# Altium schematic sheet ClockGenerator.SchDoc
size A4; SheetNumber: 1; SheetTotal: 5
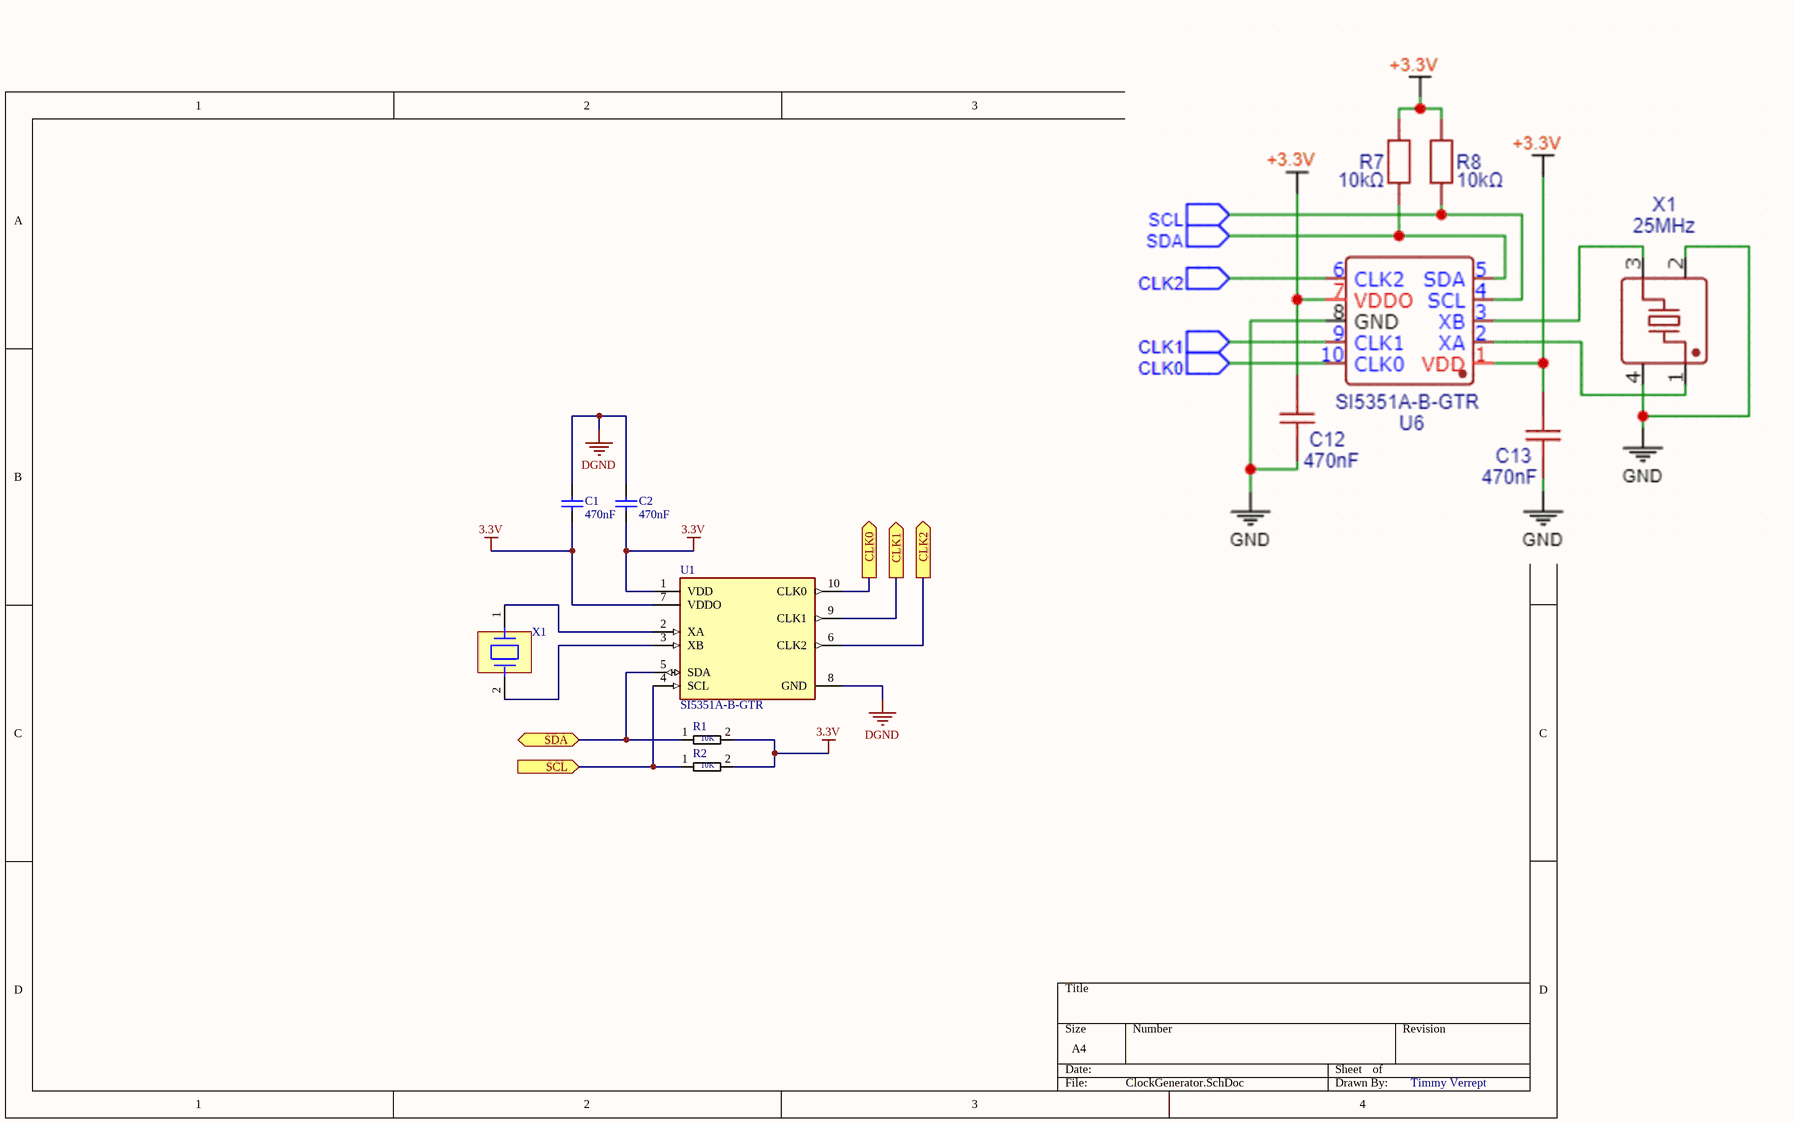
[diagram p0: ClockGenerator.SchDoc]

## Parts
C1  470nF  [SMD_CAPACITOR]
C2  470nF  [SMD_CAPACITOR]
R1  10K  [SMD_RESISTOR]
R2  10K  [SMD_RESISTOR]
U1  SI5351A-B-GTR  [ClockGenerator]
X1  ABM8W-25.0000MHZ-8-D1X-T3  [Crystal]  (value not drawn)

## Ports
CLK0 (out, see SpectrumAnalyzer[3A]), CLK1 (out, see SpectrumAnalyzer[3B]), CLK2 (out, see SpectrumAnalyzer[3C]), SCL (in, see ESP32-Controls[1B]), SDA (bidir, see ESP32-Controls[1B])

## Nets
3.3V: C1.1 C2.1 R1.2 R2.2 U1.1(VDD) U1.7(VDDO)
DGND: C1.2 C2.2 U1.8(GND)
CLK0: U1.10(CLK0) ; port CLK0
CLK1: U1.9(CLK1) ; port CLK1
CLK2: U1.6(CLK2) ; port CLK2
SCL: R2.1 U1.4(SCL) ; port SCL
SDA: R1.1 U1.5(SDA) ; port SDA
NetU1_2: U1.2(XA) X1.1
NetU1_3: U1.3(XB) X1.2

## Notes on the sheet
- Timmy Verrept

## Library data of the parts
C1 C2 = CER Capacitor: Manufacturer: Vitramon; Part Number: VJ0805Y682KXAMT
R1 R2 = Resistor: RES SMD 681 OHM 0.1% 1/8W 0805; Manufacturer: Yageo; Manufacturer Part Number: RT0805BRD07681RL; Value: 681Ω; Temperature Coefficient: 25 ppm/°C; Power Rating: 0.125W; Voltage Rating: 150V; Tolerance: 0.0025; ComponentLink2URL: http://www.yageo.com/documents/recent/PYu-RT_1-to-0.01_RoHS_L_9.pdf; Ipc Land Pattern Name: RESC200125X50; Footprint Url: http://www.yageo.com/exep/pages/download/literatures/PYu-R_Mount_10.pdf; Temperature: -55°C to +155°C; Resistance: 681Ω; Mouser Description: Thin Film Resistors - SMD 1/8W 681 ohm .1% 25ppm; Temperature Range High: +155°C; Device Class L3: Chip SMD Resistors; Automotive: No; Octopart: https://octopart.com/rt0805brd07681rl-yageo-1270194; Device Class L1: Passive Components; Package: RT0805; Device Class L2: Resistors; Category: Res; RoHS: TRUE; Composition: Thin Film; ComponentLink2Description: Datasheet; Temperature Range Low: -55°C; Lead Free: Yes; Digikey Description: RES SMD 681 OHM 0.1% 1/8W 0805; Height: 0.6mm; Series: RT
U1 = Clock Generator: IC CLK GENERATOR 200MHZ 10MSOP; PLL: Yes; Number of Circuits: 2; Max Duty Cycle: 55%; Operating Supply Voltage: 3.3V; Input: Crystal; Number of Outputs: 3; Operating Supply Current: 22mA; Packaging: Tape and Reel; Max Frequency: 200MHz; Min Operating Temperature: -40°C; Case/Package: MSOP; Mount: Surface Mount; Max Operating Temperature: 85°C; RoHS Compliant: Yes; Series: MultiSynth™; Number of Pins: 10; Package Quantity: 2500
X1 = Crystal: Crystal 25.0000Mhz 8Pf Smd Rohs Compliant: Yes |Abracon ABM8W-25.0000MHZ-8-D1X-T3; Symbol Hash: 5ad2309f83030e0db84e76142195c3471039205ed86bf5db55117304b0c05392; Frequency: 25MHz; Tolerance: 10ppm; Verification Version: 0.0.0.3; Stability: 20ppm; Esr: 50Ω; Mouser Part Number: 815-8W25-8D1XT; Mouser Description: Crystal 25.0000Mhz 8Pf Smd Rohs Compliant: Yes |Abracon ABM8W-25.0000MHZ-8-D1X-T3; Datasheet Date: 2022-07-11; Temperature Range High: +85°C; Part Number: ABM8W-25.0000MHZ-8-D1X-T3; Digikey Description: CRYSTAL 25.0000MHZ 8PF SMD; Digikey Part Number: 535-14059-1-ND; ComponentLink2URL: https://abracon.com/datasheets/ABM8W.pdf; ComponentLink2Description: Datasheet URL; Lead Free: Yes; Height: 0.75mm; Automotive: No; Temperature Range Low: -40°C; RoHS: Compliant; Manufacturer: Abracon; Package: ABM8W; Load Capacitance: 8pF; Series: ABM8W; ComponentLink1Description: Upverter; Supplier 2: Mouser; Supplier 1: Digi-Key; ComponentLink1URL: https://upverter.com/part/id/6105b10e08f999b5/; Supplier Part Number 2: 815-8W25-8D1XT; Supplier Part Number 1: 535-14059-1-ND; HelpURL: https://abracon.com/datasheets/ABM8W.pdf; Temperature: -40°C to +85°C; Schedule B: 8541600080